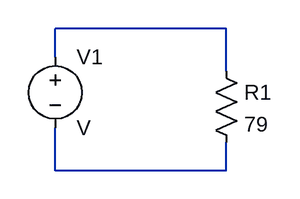
[diagram p0: schematic Draft2.asc]
Draft2.asc, the LTspice schematic file:
Version 4
SHEET 1 880 680
WIRE 288 80 96 80
WIRE 96 112 96 80
WIRE 288 128 288 80
WIRE 96 240 96 192
WIRE 288 240 288 208
WIRE 288 240 96 240
SYMBOL res 272 112 R0
SYMATTR InstName R1
SYMATTR Value 79
SYMBOL voltage 96 96 R0
SYMATTR InstName V1

The netlist it stands for:
* Draft2.asc
R1 N001 N002 79
V1 N001 N002 V
.backanno
.end